# EAGLE design Galaksija keyboard adapter (EAGLE 9.6.2)
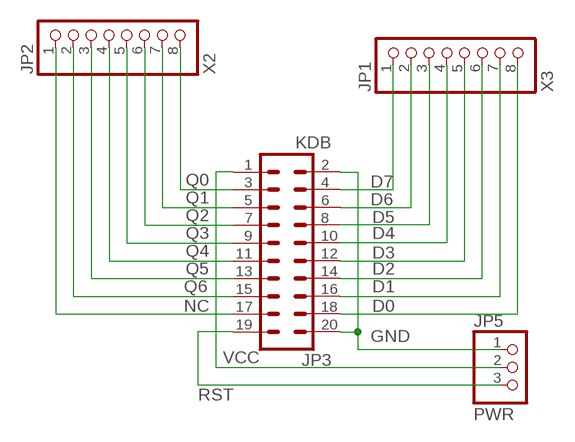
[diagram p0: schematic, sheet 1]

## Parts
JP1  X3  PINHD-1X8  [1X08]
JP2  X2  PINHD-1X8  [1X08]
JP3  KDB  ML20  [ML20]
JP5  PWR  PINHD-1X3  [1X03]

## Nets
D0: JP1.8 JP3.18
D1: JP1.7 JP3.16
D2: JP1.6 JP3.14
D3: JP1.5 JP3.12
D4: JP1.4 JP3.10
D5: JP1.3 JP3.8
D6: JP1.2 JP3.6
D7: JP1.1 JP3.4
GND: JP3.2 JP3.20 JP5.1
NC: JP2.1 JP3.17
Q0: JP2.8 JP3.3
Q1: JP2.7 JP3.5
Q2: JP2.6 JP3.7
Q3: JP2.5 JP3.9
Q4: JP2.4 JP3.11
Q5: JP2.3 JP3.13
Q6: JP2.2 JP3.15
RST: JP3.19 JP5.3
VCC: JP3.1 JP5.2

## Library data of the parts
JP1 JP2 = pinhead:PINHD-1X8: PIN HEADER
JP3 = con-harting-ml:ML20: HARTING; OC_FARNELL: unknown; OC_NEWARK: unknown
JP5 = pinhead:PINHD-1X3: PIN HEADER

## Board
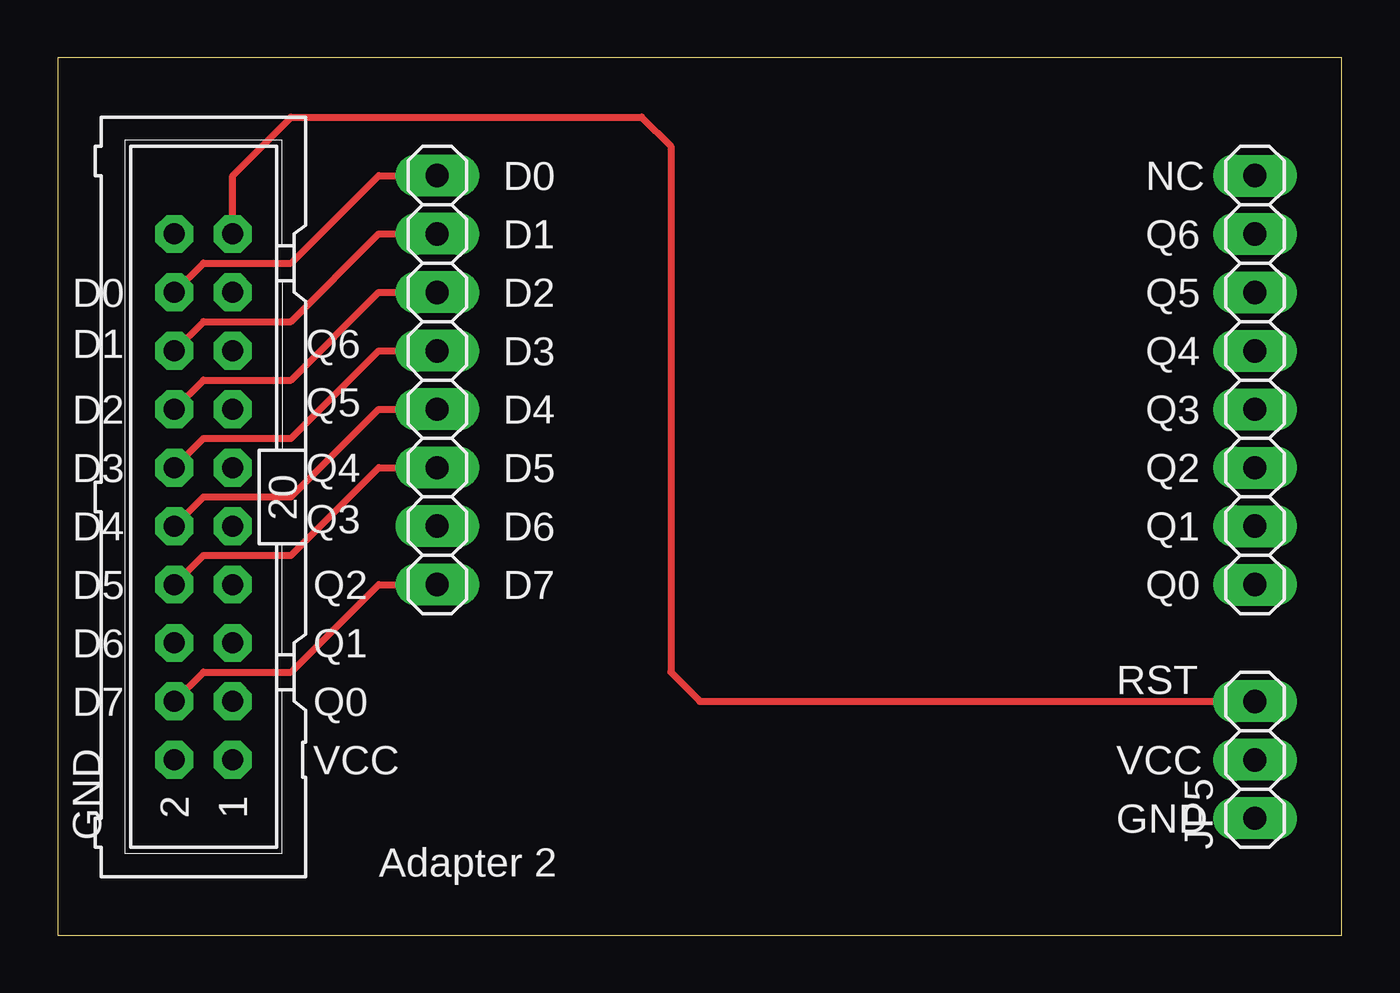
[diagram p1: board, top side]
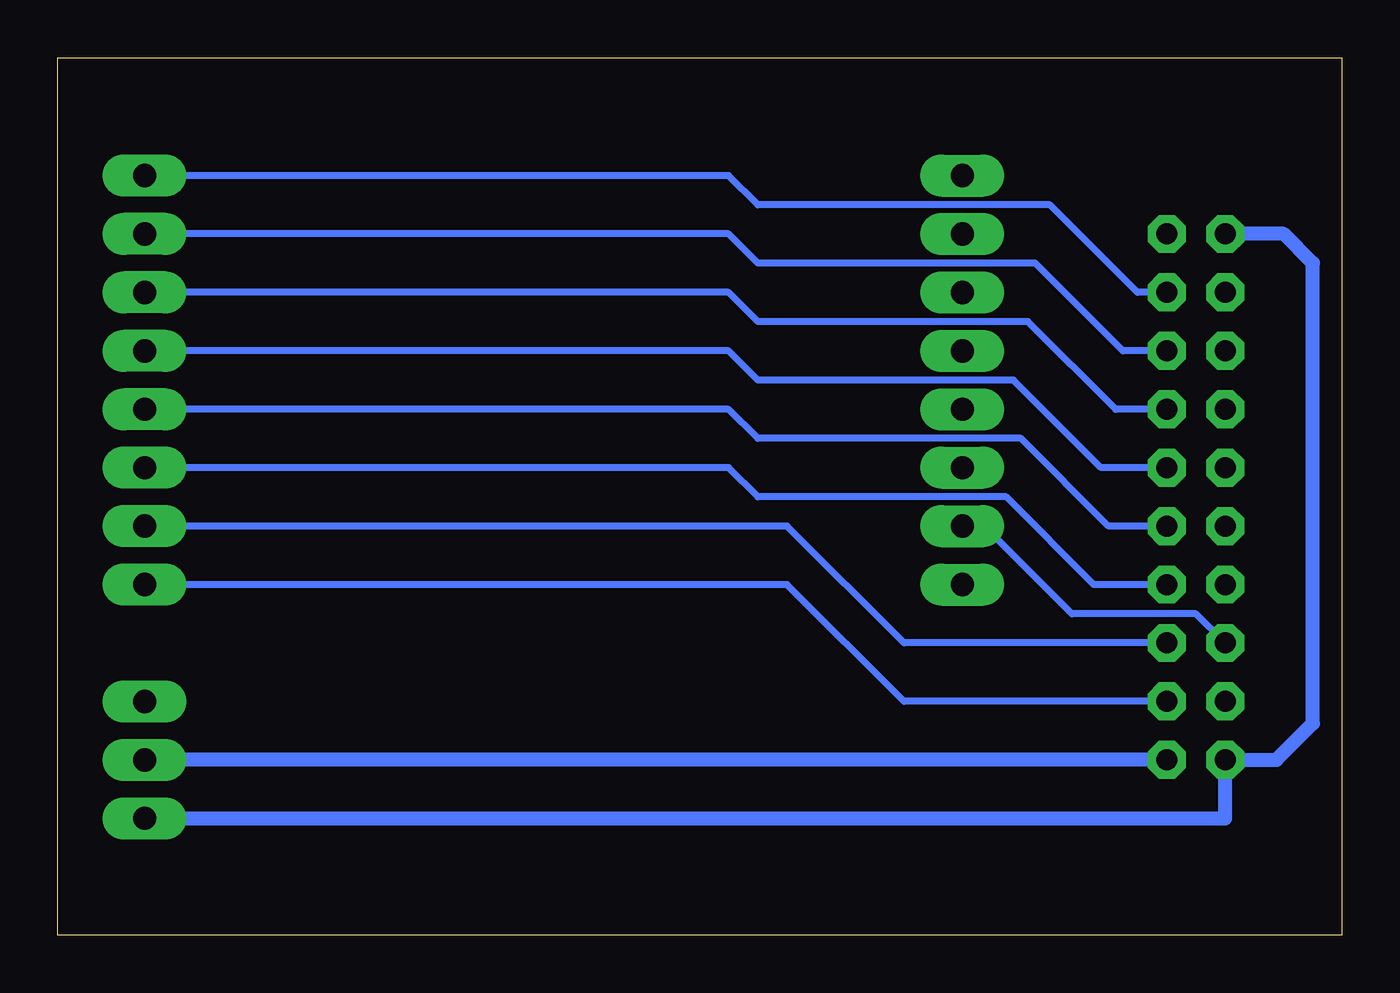
[diagram p2: board, bottom side, seen from below]

Size 55.86 x 38.15 mm. Coordinates in mm from the lower left corner, seen from the top.
Outline: 0,0 55.86,0 55.86,38.15 0,38.15 0,0
Copper layers (1*16): Top 0.035mm / dielectric 1.6mm / Bottom 0.035mm
Design rules "jlcpcb-2layers": minimum track width 5mil, minimum drill 0.3mm, track to track 5mil, track to pad 5mil, pad to pad 5mil, via to via 5mil, smd to smd 5mil, copper to edge 0.2mm, drill to drill 6mil, minimum pad ring 10mil, minimum via ring 3mil, stop-mask expansion 4mil, vias tented up to drill 0mil, thermal gap 10mil

### Footprints (pad centres in the part's own frame; a part is rotated, then mirrored left to right if it is on the bottom)
1X08 = drill 1.016 long: 1 -8.89,0; 2 -6.35,0; 3 -3.81,0; 4 -1.27,0; 5 1.27,0; 6 3.81,0; 7 6.35,0; 8 8.89,0
ML20 = drill 0.914 octagon: 1 -11.43,-1.27; 2 -11.43,1.27; 3 -8.89,-1.27; 4 -8.89,1.27; 5 -6.35,-1.27; 6 -6.35,1.27; 7 -3.81,-1.27; 8 -3.81,1.27; 9 -1.27,-1.27; 10 -1.27,1.27; 11 1.27,-1.27; 12 1.27,1.27; 13 3.81,-1.27; 14 3.81,1.27; 15 6.35,-1.27; 16 6.35,1.27; 17 8.89,-1.27; 18 8.89,1.27; 19 11.43,-1.27; 20 11.43,1.27
1X03 = drill 1.016 long: 1 -2.54,0; 2 0,0; 3 2.54,0

### Placement (x,y rotation side)
JP1  16.51,24.13 90 top
JP2  52.07,24.13 270 top
JP3  6.35,19.05 90 top
JP5  52.07,7.62 90 top

### Tracks (layer width: path | path; a pad name or v marks a point on that pad's centre or on a via)
D0
  Top 0.305: JP1.8 13.97,33.02 10.16,29.21 6.35,29.21 JP3.18
D1
  Top 0.305: JP3.16 6.35,26.67 10.16,26.67 13.97,30.48 JP1.7
D2
  Top 0.305: JP3.14 6.35,24.13 10.16,24.13 13.97,27.94 JP1.6
D3
  Top 0.305: JP3.12 6.35,21.59 10.16,21.59 13.97,25.4 JP1.5
D4
  Top 0.305: JP3.10 6.35,19.05 10.16,19.05 13.97,22.86 JP1.4
D5
  Top 0.305: JP3.8 6.35,16.51 10.16,16.51 13.97,20.32 JP1.3
D6
  Bottom 0.305: JP3.6 6.35,13.97 11.75,13.97 15.56,17.78 JP1.2
D7
  Top 0.305: JP3.4 6.35,11.43 10.16,11.43 13.97,15.24 JP1.1
GND
  Bottom 0.61: JP5.1 5.08,5.08 JP3.2 2.86,7.62 1.27,9.21 1.27,29.21 2.54,30.48 JP3.20
NC
  Bottom 0.305: JP3.17 8.89,27.94 12.7,31.75 25.4,31.75 26.67,33.02 JP2.1
Q0
  Bottom 0.305: JP3.3 19.05,10.16 24.13,15.24 JP2.8
Q1
  Bottom 0.305: JP3.5 19.05,12.7 24.13,17.78 JP2.7
Q2
  Bottom 0.305: JP3.7 10.79,15.24 14.61,19.05 25.4,19.05 26.67,20.32 JP2.6
Q3
  Bottom 0.305: JP3.9 10.16,17.78 13.97,21.59 25.4,21.59 26.67,22.86 JP2.5
Q4
  Bottom 0.305: JP3.11 10.48,20.32 14.29,24.13 25.4,24.13 26.67,25.4 JP2.4
Q5
  Bottom 0.305: JP3.13 9.84,22.86 13.65,26.67 25.4,26.67 26.67,27.94 JP2.3
Q6
  Bottom 0.305: JP3.15 9.53,25.4 13.34,29.21 25.4,29.21 26.67,30.48 JP2.2
RST
  Top 0.305: JP3.19 7.62,33.02 10.16,35.56 25.4,35.56 26.67,34.29 26.67,11.43 27.94,10.16 JP5.3
VCC
  Bottom 0.61: JP3.1 JP5.2

### Text on the board
tPlace: D0 | NC | D1 | Q6 | D0 | D2 | Q5 | D1 | Q6 | D3 | Q4 | Q5 | D2 | D4 | Q3 | D3 | Q4 | D5 | Q2 | D4 | Q3 | D6 | Q1 | D5 | Q2 | D7 | Q0 | D6 | Q1 | D7 | Q0 | RST | VCC | VCC | GND | GND | Adapter 2